# EAGLE design pistachio-32u4 (EAGLE 5.11)
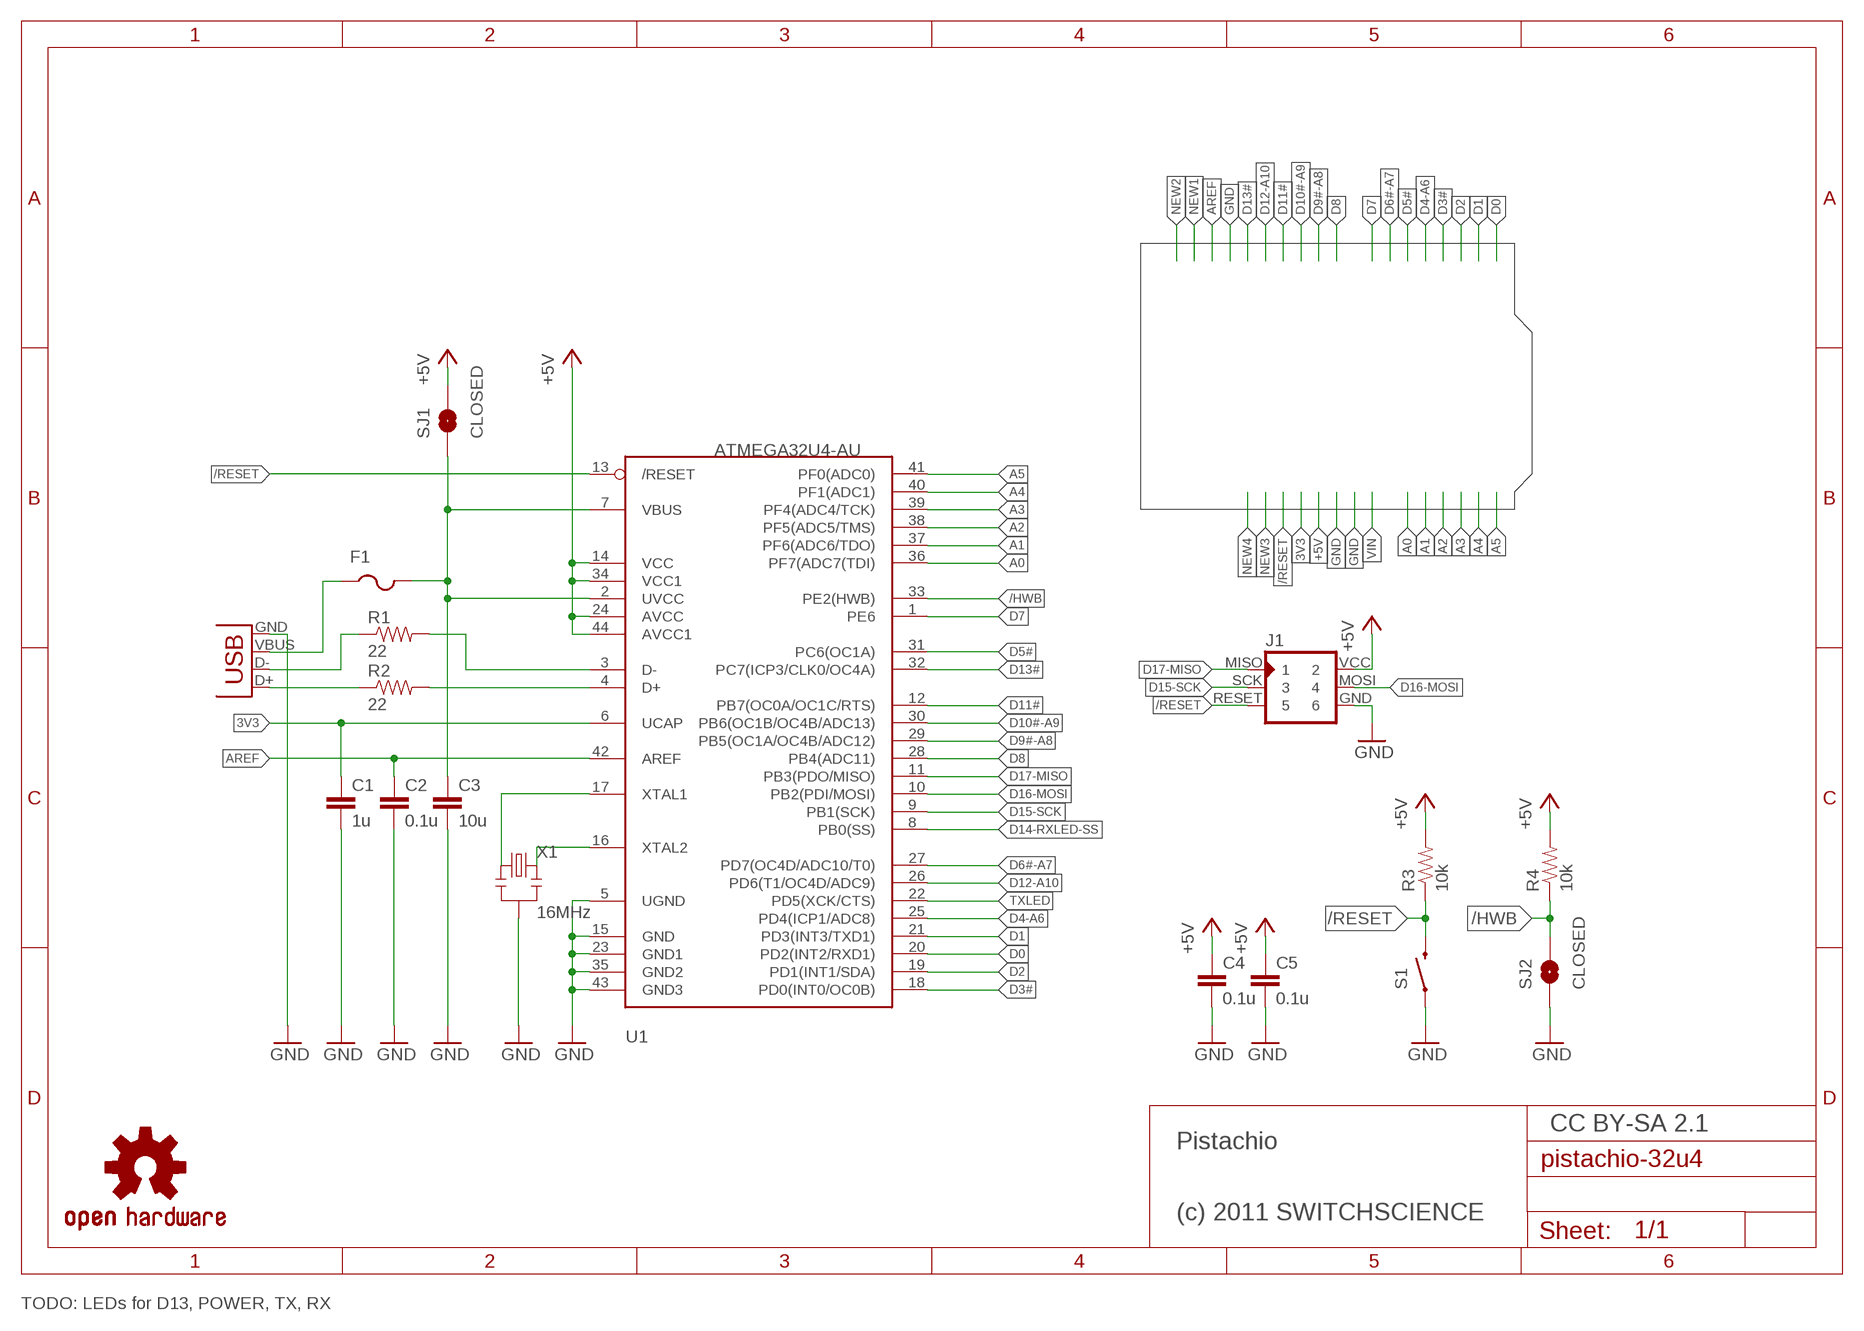
[diagram p0: schematic, sheet 1]

## Parts
C1  1u  CAP0603-CAP  [0603-CAP]
C2  0.1u  CAP0603-CAP  [0603-CAP]
C3  10u  CAP0603-CAP  [0603-CAP]
C4  0.1u  CAP0603-CAP  [0603-CAP]
C5  0.1u  CAP0603-CAP  [0603-CAP]
F1  PTCFUSE-1206  [R1206]
J1  AVR-ISP-6PIN  [AVR-ISP-6PIN]
R1  22  RESISTOR0603-RES  [0603-RES]
R2  22  RESISTOR0603-RES  [0603-RES]
R3  10k  RESISTOR0603-RES  [0603-RES]
R4  10k  RESISTOR0603-RES  [0603-RES]
S1  SWITCH-MOMENTARY-2-SMD-1101NE  [TACTILE-SWITCH-1101NE]
SJ1  CLOSED  SOLDERJUMPERTRACE  [SJ_2S-TRACE]
SJ2  CLOSED  SOLDERJUMPERTRACE  [SJ_2S-TRACE]
U1  ATMEGA32U4-AU  [TQFP44]
U$2  OSHW-LOGOS  [OSHW-LOGO-S]
X1  16MHz  RESONATORSMD  [RESONATOR-SMD]
X2  USB-MICROB  [USB-MICROB]

## Nets
3V3: C1.1 U1.6(UCAP)
+5V: C4.1 C5.1 J1.VCC R3.2 R4.2 SJ1.2 U1.14(VCC) U1.24(AVCC) U1.34(VCC1) U1.44(AVCC1)
/HWB: R4.1 SJ2.2 U1.33(PE2(HWB))
/RESET: J1.RESET R3.1 S1.P$2 U1.13(/RESET)
A0: U1.36(PF7(ADC7(TDI))
A1: U1.37(PF6(ADC6/TDO))
A2: U1.38(PF5(ADC5/TMS))
A3: U1.39(PF4(ADC4/TCK))
A4: U1.40(PF1(ADC1))
A5: U1.41(PF0(ADC0))
AREF: C2.1 U1.42(AREF)
D0: U1.20(PD2(INT2/RXD1))
D1: U1.21(PD3(INT3/TXD1))
D2: U1.19(PD1(INT1/SDA))
D3#: U1.18(PD0(INT0/OC0B))
D4-A6: U1.25(PD4(ICP1/ADC8))
D5#: U1.31(PC6(OC1A))
D6#-A7: U1.27(PD7(OC4D/ADC10/T0))
D7: U1.1(PE6)
D8: U1.28(PB4(ADC11))
D9#-A8: U1.29(PB5(OC1A/OC4B/ADC12))
D10#-A9: U1.30(PB6(OC1B/OC4B/ADC13))
D11#: U1.12(PB7(OC0A/OC1C/RTS))
D12-A10: U1.26(PD6(T1/OC4D/ADC9))
D13#: U1.32(PC7(ICP3/CLK0/OC4A))
D14-RXLED-SS: U1.8(PB0(SS))
D15-SCK: J1.SCK U1.9(PB1(SCK))
D16-MOSI: J1.MOSI U1.10(PB2(PDI/MOSI))
D17-MISO: J1.MISO U1.11(PB3(PDO/MISO))
GND: C1.2 C2.2 C3.2 C4.2 C5.2 J1.GND S1.P$1 SJ2.1 U1.5(UGND) U1.15(GND) U1.23(GND1) U1.35(GND2) U1.43(GND3) X1.2 X2.GND
N$1: U1.16(XTAL2) X1.3
N$2: U1.17(XTAL1) X1.1
N$3: R1.1 X2.D-
N$4: R2.1 X2.D+
N$5: R1.2 U1.3(D-)
N$6: R2.2 U1.4(D+)
N$7: F1.1 X2.VBUS
TXLED: U1.22(PD5(XCK/CTS))
VBUS: C3.1 F1.2 SJ1.1 U1.2(UVCC) U1.7(VBUS)

## Notes on the sheet
- CC BY-SA 2.1
- Pistachio
- (c) 2011 SWITCHSCIENCE
- TODO: LEDs for D13, POWER, TX, RX

## Library data of the parts
C1-C5 = SparkFun:CAP: Capacitor Standard 0603 ceramic capacitor, and 0.1" leaded capacitor.
F1 = adafruit:PTCFUSE: PTC fuses, resettable thermistors
J1 = avr-isp:AVR-ISP-6PIN: AVR ISP 6pin 3x2 pin header
R1-R4 = SparkFun:RESISTOR: Resistor Basic schematic elements and footprints for 0603, 1206, and PTH resistors.
S1 = SparkFun:SWITCH-MOMENTARY-2
SJ1 SJ2 = SparkFun:SOLDERJUMPER: Solder Jumper Standard SMD solder jumper. Used to automate production. Two varients : Normally Open and Normally Closed are the same, but have different paste layers. NC will have a large amount of paste and should jumper during reflow.
U1 = adafruit:ATMEGA32U4: http://www.ladyada.net/library/eagle
U$2 = SparkFun:OSHW-LOGO: Open Source Hardware Logo This logo indicates the piece of hardware it is found on incorporates a OSHW license and/or adheres to the definition of open source hardware found here: http://freedomdefined.org/OSHW
X1 = SparkFun:RESONATOR: Resonator Small SMD resonator. This is the itty bitty 10/20MHz resonators with built in caps. CSTCE10M0G55 and CSTCE20M0V53. Footprint has been reviewed closely but hasn't been tested yet.
X2 = SparkFun:USB: USB Connectors USB-B-PTH is fully proven SKU : PRT-00139 USB-miniB is fully proven SKU : PRT-00587 USB-A-PCB is untested. USB-A-H is throughly reviewed, but untested. Spark Fun Electronics SKU : PRT-00437 USB-B-SMT is throughly reviewed, but untested. Needs silkscreen touching up. USB-A-S has not been used/tested USB-MB-H has not been used/tested

## Board
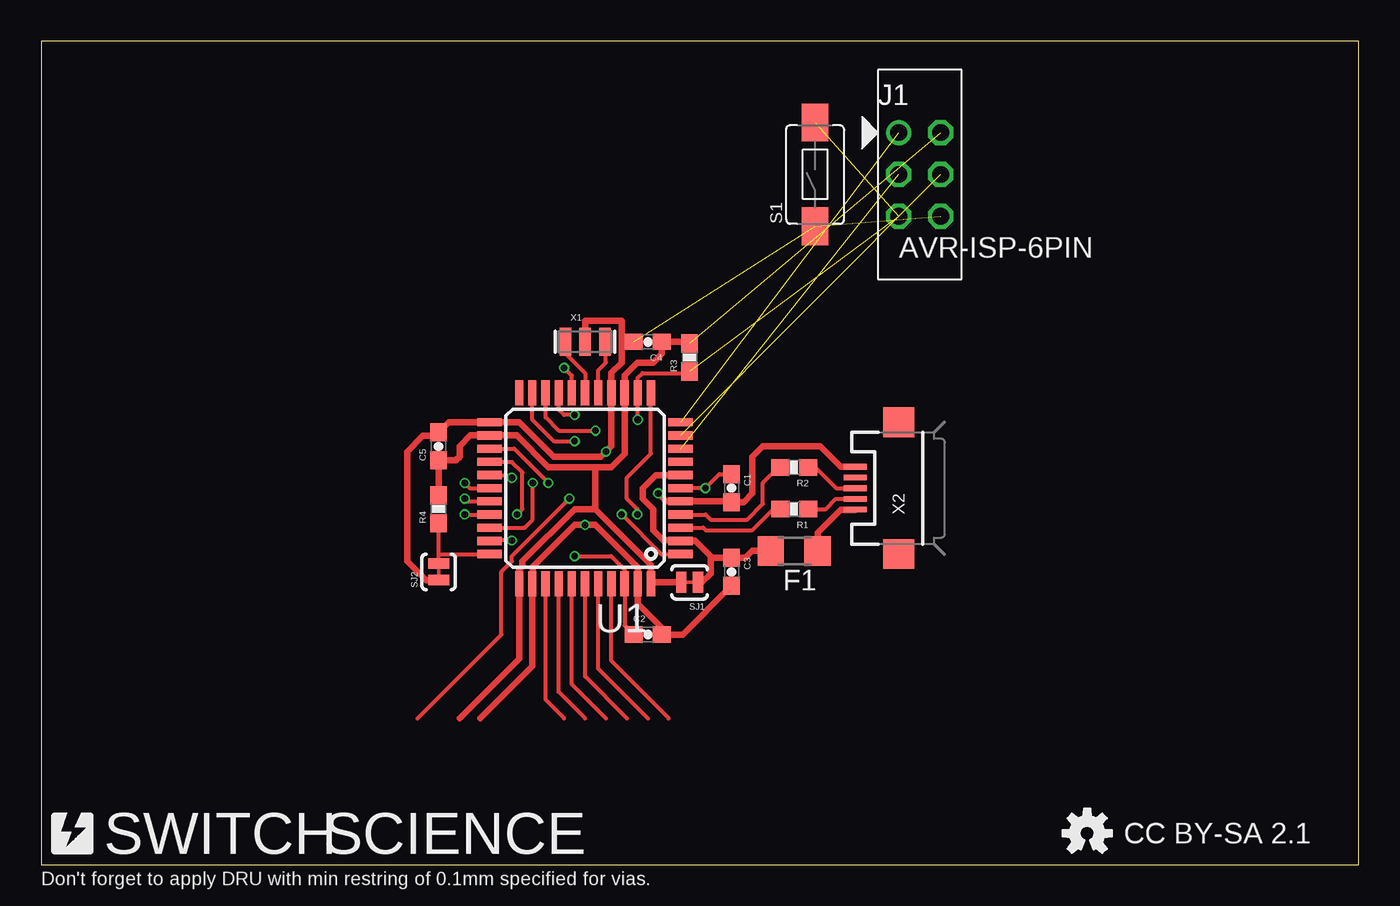
[diagram p1: board, top side]
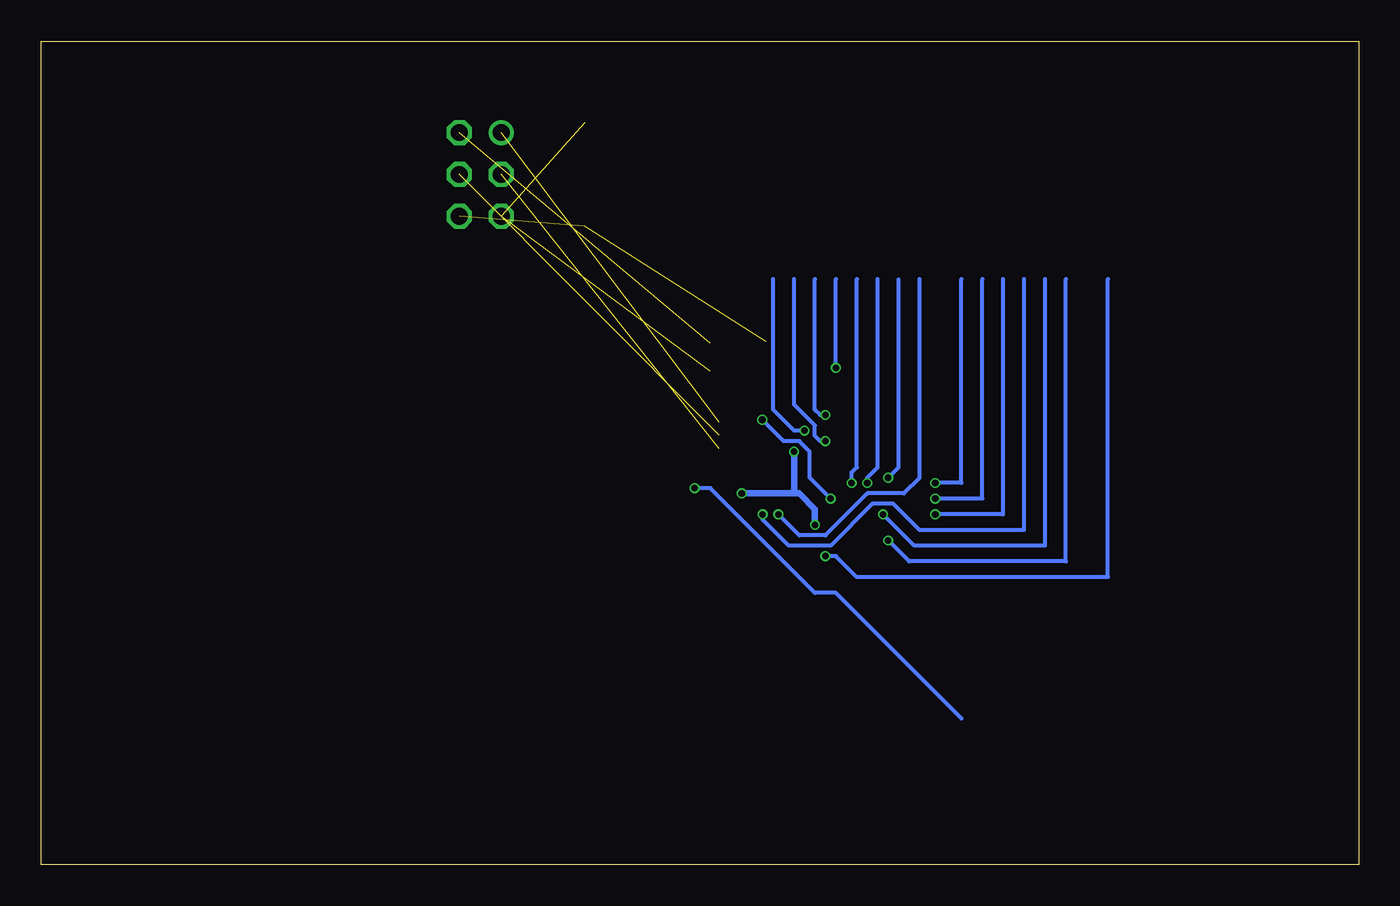
[diagram p2: board, bottom side, seen from below]

Size 80 x 50 mm. Coordinates in mm from the lower left corner, seen from the top.
Outline: 0,0 80,0 80,50 0,50 0,0
Copper layers (1*16): Top 0.035mm / dielectric 1.5mm / Bottom 0.035mm
Design rules "PCBCartFine": minimum track width 0.2mm, minimum drill 0.4mm, track to track 0.2mm, track to pad 0.2mm, pad to pad 0.2mm, via to via 0.2mm, smd to smd 0.2mm, copper to edge 0.2mm, drill to drill 0.2mm, minimum pad ring 0.1mm, minimum via ring 0.1mm, stop-mask expansion 4mil, vias tented up to drill 0.5mm, thermal gap 0.2mm

### Footprints (pad centres in the part's own frame; a part is rotated, then mirrored left to right if it is on the bottom)
0603-CAP = smd 1.1 x 1: 1 -0.85,0; 2 0.85,0
R1206 = smd 1.6 x 1.803: 1 -1.422,0; 2 1.422,0
AVR-ISP-6PIN = drill 1.016 octagon: GND 1.27,-2.54; MOSI 1.27,0; RESET -1.27,-2.54; SCK -1.27,0; VCC 1.27,2.54 | drill 1.016 round: MISO -1.27,2.54
0603-RES = smd 1.1 x 1: 1 -0.85,0; 2 0.85,0
TACTILE-SWITCH-1101NE = smd 2.3 x 1.6: P$1 -3.15,0; P$2 3.15,0
SJ_2S-TRACE = smd 0.635 x 1.27: 1 -0.508,0; 2 0.508,0
TQFP44 = smd 1.5 x 0.5: 1 -5.8,4; 2 -5.8,3.2; 3 -5.8,2.4; 4 -5.8,1.6; 5 -5.8,0.8; 6 -5.8,0; 7 -5.8,-0.8; 8 -5.8,-1.6; 9 -5.8,-2.4; 10 -5.8,-3.2; 11 -5.8,-4; 23 5.8,-4; 24 5.8,-3.2; 25 5.8,-2.4; 26 5.8,-1.6; 27 5.8,-0.8; 28 5.8,0; 29 5.8,0.8; 30 5.8,1.6; 31 5.8,2.4; 32 5.8,3.2; 33 5.8,4 | smd 0.5 x 1.5: 12 -4,-5.8; 13 -3.2,-5.8; 14 -2.4,-5.8; 15 -1.6,-5.8; 16 -0.8,-5.8; 17 0,-5.8; 18 0.8,-5.8; 19 1.6,-5.8; 20 2.4,-5.8; 21 3.2,-5.8; 22 4,-5.8; 34 4,5.8; 35 3.2,5.8; 36 2.4,5.8; 37 1.6,5.8; 38 0.8,5.8; 39 0,5.8; 40 -0.8,5.8; 41 -1.6,5.8; 42 -2.4,5.8; 43 -3.2,5.8; 44 -4,5.8
RESONATOR-SMD = smd 0.7 x 1.7: 1 -1.2,0; 2 0,0; 3 1.2,0
USB-MICROB = smd 0.35 x 1.4: D+ 0,2.65; D- -0.65,2.65; GND 1.3,2.65; ID 0.65,2.65; VBUS -1.3,2.65 | smd 1.8 x 1.9: MT1 -4,0; MT2 4,0

### Placement (x,y rotation side)
C1  41.91,22.86 270 top
C2  36.83,13.97 0 top
C3  41.91,17.78 270 top
C4  36.83,31.75 180 top
C5  24.13,25.4 90 top
F1  45.72,19.05 180 top
J1  53.34,41.91 0 top
R1  45.72,21.59 180 top
R2  45.72,24.13 180 top
R3  39.37,30.8 90 top
R4  24.13,21.59 90 top
S1  46.99,41.91 90 top
SJ1  39.37,17.14 180 top
SJ2  24.13,17.78 90 top
U1  33.02,22.86 180 top
U$1  [LOGO]  0.64,0.64 0 top
U$2  63.5,1.91 0 top
X1  33.02,31.75 0 top
X2  52.07,22.86 90 top

### Tracks (layer width: path | path; a pad name or v marks a point on that pad's centre or on a via)
3V3  (via drill 0.4)
  Top 0.2: C1.1 41.91,23.5
  Top 0.254: U1.6 v40.32,22.86 41.17,23.71 C1.1
  Bottom 0.254: v40.32,22.86 39.37,22.86 33.02,16.51 31.75,16.51 24.13,8.89
+5V  (1 unrouted)
  Top 0.254: 39.27,31.75 R3.2 | U1.44 37.1,17.14
  Top 0.406: R4.2 C5.1 25.18,24.55 25.4,24.77 25.4,25.4 26.06,26.06 U1.24 28.87,26.06 30.8,24.13 33.66,24.13 | U1.44 37.02,18.23 33.66,21.59 | 33.66,21.59 32.38,21.59 29.21,18.41 29.21,18.1 29.02,17.91 U1.34 29.02,12.51 25.4,8.89 | 33.66,21.59 33.66,24.13 | 39.27,31.75 C4.1 37.68,31.01 37.15,30.48 36.2,30.48 35.42,29.7 U1.14 35.42,24.94 34.61,24.13 33.66,24.13 | 37.1,17.14 SJ1.2
/HWB
  Top 0.254: SJ2.2 24.13,18.86 | 24.13,18.86 U1.33 | 24.13,18.86 R4.1
/RESET  (via drill 0.4)  (2 unrouted)
  Top 0.254: R3.1 39.27,29.84 36.51,29.84 36.22,29.55 U1.13 v36.22,27.01 | v32.07,22.23 28.57,18.73 28.57,18.41 27.94,17.78 27.94,13.97 22.86,8.89
  Bottom 0.254: v32.07,22.23 33.34,23.5 33.34,25.08 33.97,25.72 34.92,25.72 v36.22,27.01
A0
  Top 0.254: U1.36 30.62,10.02 31.75,8.89
A1
  Top 0.254: U1.37 31.42,10.49 33.02,8.89
A2
  Top 0.254: U1.38 32.22,10.96 34.29,8.89
A3
  Top 0.254: U1.39 33.02,11.43 35.56,8.89
A4
  Top 0.254: U1.40 33.82,11.9 36.83,8.89
A5
  Top 0.254: U1.41 34.62,12.37 38.1,8.89
AREF  (via drill 0.4)
  Top 0.254: v32.38,18.73 34.61,18.73 35.42,17.92 35.42,17.78 U1.42 35.42,14.53 C2.1
  Bottom 0.254: v32.38,18.73 31.75,18.73 30.48,17.46 15.24,17.46 15.24,35.56
D0  (via drill 0.4)
  Top 0.254: U1.20 30.62,27.16 31.43,26.35 v33.66,26.35
  Bottom 0.254: v33.66,26.35 34.29,26.35 35.56,27.62 35.56,35.56
D1  (via drill 0.4)
  Top 0.254: U1.21 29.82,27.01 31.11,25.72 v32.38,25.72
  Bottom 0.254: v32.38,25.72 32.7,25.72 33.02,26.04 33.02,26.67 34.29,27.94 34.29,35.56
D2  (via drill 0.4)
  Top 0.254: U1.19 31.42,27.64 31.75,27.3 v32.38,27.3
  Bottom 0.254: v32.38,27.3 32.7,27.3 33.02,27.62 33.02,35.56
D3#  (via drill 0.4)
  Top 0.254: U1.18 32.22,29.69 v31.75,30.16
  Bottom 0.254: v31.75,30.16 31.75,35.56
D4-A6  (via drill 0.4)
  Top 0.254: U1.25 28.71,25.26 v30.8,23.18
  Bottom 0.254: v30.8,23.18 30.8,23.81 30.48,24.13 30.48,35.56
D5#  (via drill 0.4)
  Top 0.254: U1.31 29.35,20.46 29.84,20.95 v29.84,23.18
  Bottom 0.254: v29.84,23.18 29.84,23.5 29.21,24.13 29.21,35.56
D6#-A7  (via drill 0.4)
  Top 0.254: U1.27 28.42,23.66 v28.57,23.5
  Bottom 0.254: v28.57,23.5 27.94,24.13 27.94,35.52
D7  (via drill 0.4)
  Top 0.254: U1.1 37.66,18.86 v35.24,21.27
  Bottom 0.254: v35.24,21.27 33.97,20 32.38,20 29.84,22.54 27.62,22.54 26.67,23.5 26.67,35.56
D8  (via drill 0.4)
  Top 0.254: U1.28 26.04,22.86 v25.72,23.18
  Bottom 0.254: v25.72,23.18 24.13,23.18 24.13,35.56
D9#-A8  (via drill 0.4)
  Top 0.254: U1.29 25.88,22.06 v25.72,22.23
  Bottom 0.254: v25.72,22.23 22.86,22.23 22.86,35.56
D10#-A9  (via drill 0.4)
  Top 0.254: U1.30 v25.73,21.26 v25.72,21.27
  Bottom 0.254: v25.72,21.27 21.59,21.27 21.59,35.56
D11#  (via drill 0.4)
  Top 0.254: U1.12 37.02,24.95 35.56,23.5 35.56,22.23 36.2,21.59 v36.2,21.27
  Bottom 0.254: v36.2,21.27 36.2,20.95 34.61,19.37 32.07,19.37 29.53,21.91 28.26,21.91 26.67,20.32 20.32,20.32 20.32,35.56
D12-A10  (via drill 0.4)
  Top 0.2: 27.3,24.45 U1.26
  Top 0.254: 27.3,24.45 28.57,24.45 29.21,23.81 29.21,21.59 v28.89,21.27
  Bottom 0.254: v28.89,21.27 26.99,19.37 19.05,19.37 19.05,35.56
D13#  (via drill 0.4)
  Top 0.2: 27.3,19.68 U1.32
  Top 0.254: v28.57,19.68 27.3,19.68
  Bottom 0.254: v28.57,19.68 27.3,18.41 17.78,18.41 17.78,35.56
D15-SCK  (1 unrouted)
D16-MOSI  (1 unrouted)
D17-MISO  (1 unrouted)
GND  (via drill 0.4)  (2 unrouted)
  Top 0.2: 34.61,28.57 U1.15 | U1.35 29.84,17.14 | C1.2 41.91,21.91
  Top 0.254: 37.68,14.39 C2.2 | 41.86,22.06 C1.2 | C5.2 23.91,26.04
  Top 0.406: 37.68,14.39 36.22,15.85 U1.43 36.22,18.07 33.66,20.64 v33.02,20.64 32.38,20.64 29.84,18.1 29.84,17.14 | C5.2 24.74,26.86 U1.23 29.02,26.86 31.11,24.77 33.97,24.77 v34.29,25.08 34.61,25.4 34.61,28.57 | X1.2 33.02,33.02 35.24,33.02 35.24,31.75 | SJ2.1 23.37,17.27 22.23,18.41 22.23,25.08 23.18,26.04 23.91,26.04 | 41.86,22.06 U1.5 38.1,22.06 37.95,22.06 v37.47,22.54 | U1.15 34.62,29.86 35.24,30.48 35.24,31.75 | 35.24,31.75 C4.2 | U1.35 29.82,12.04 26.67,8.89 | C3.2 38.95,13.97 C2.2 | C1.2 42.65,22.01 43.18,22.54 43.18,24.77 43.81,25.4 47.31,25.4 48.55,24.16 X2.GND
  Bottom 0.406: 34.29,22.54 v37.47,22.54 | 34.29,22.54 v34.29,25.08 | 34.29,22.54 33.97,22.54 33.02,21.59 v33.02,20.64
N$1
  Top 0.254: U1.16 33.82,30.01 34.29,30.48 34.29,31.68 X1.3
N$2
  Top 0.254: X1.1 31.82,31.05 33.02,29.84 U1.17
N$3
  Top 0.254: X2.D- 48.24,22.21 47.62,21.59 R1.1
N$4
  Top 0.254: X2.D+ 48.26,22.86 46.99,24.13 R2.1
N$5
  Top 0.254: R1.2 44.45,21.59 43.18,20.32 40.32,20.32 40.18,20.46 U1.3
N$6
  Top 0.254: U1.4 40.34,21.26 40.64,20.95 42.86,20.95 43.81,21.91 43.81,23.18 44.77,24.13 R2.2
N$7
  Top 0.406: X2.VBUS 48.55,21.56 47.14,20.15 F1.1
VBUS
  Top 0.2: U1.2 38.73,19.68
  Top 0.254: U1.2 38.8,19.68 | 40.64,18.73 40.74,18.63
  Top 0.406: U1.7 37.31,23.66 36.51,22.86 36.51,22.23 37.15,21.59 37.15,20.32 37.78,19.68 38.73,19.68 | U1.2 39.71,19.66 40.64,18.73 40.64,17.67 40.12,17.14 SJ1.1 | F1.2 43.18,19.05 42.76,18.63 C3.1 40.74,18.63

### Text on the board
tNames: SWITCH | SCIENCE | CC BY-SA 2.1 | Don't forget to apply DRU with min restring of 0.1mm specified for vias.